# EAGLE design PhotoShieldV2 (EAGLE 9.2.2)
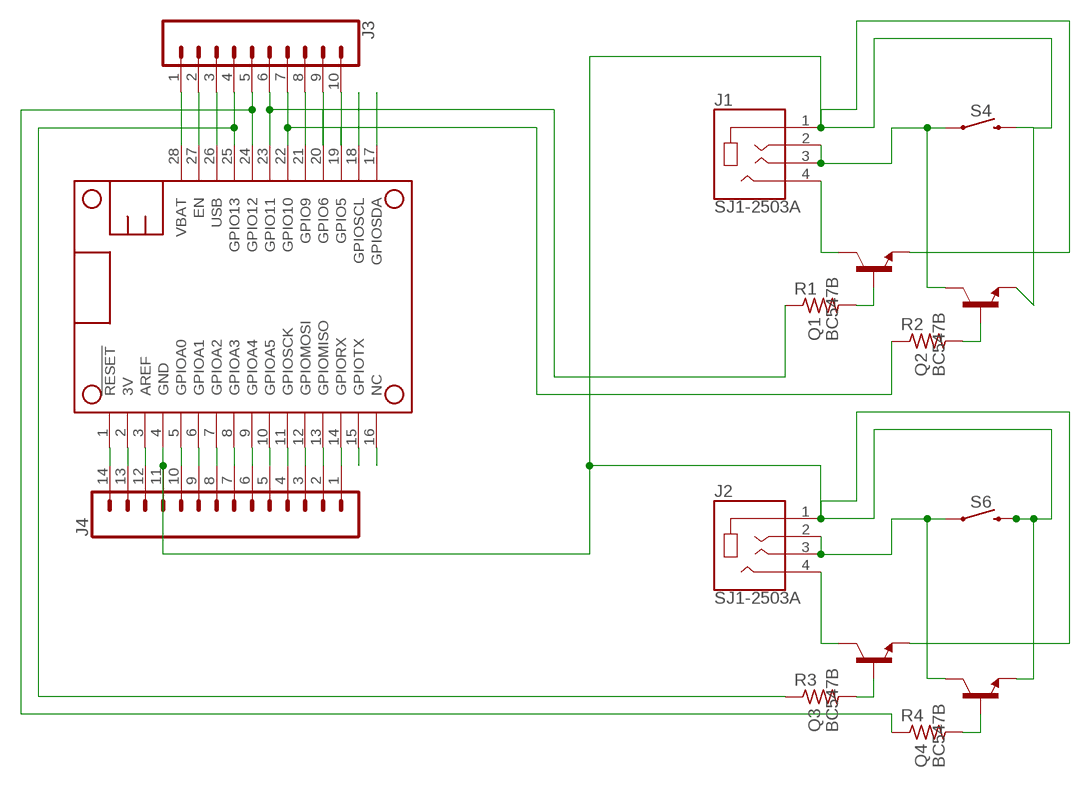
[diagram p0: schematic, sheet 1]

## Parts
J1  SJ1-2503A  [CUI_SJ1-2503A]
J2  SJ1-2503A  [CUI_SJ1-2503A]
J3  CONN_10"  [1X10]
J4  CONN_14  [1X14]
MS1  FEATHERWING  [FEATHERWING]
Q1  BC547B  [TO92]
Q2  BC547B  [TO92]
Q3  BC547B  [TO92]
Q4  BC547B  [TO92]
R1  R-US_R0805  [R0805]
R2  R-US_R0805  [R0805]
R3  R-US_R0805  [R0805]
R4  R-US_R0805  [R0805]
S4  MOMENTARY-SWITCH-SPST-SMD-4.6X2.8MM  [TACTILE_SWITCH_SMD_4.6X2.8MM]
S6  MOMENTARY-SWITCH-SPST-SMD-4.6X2.8MM  [TACTILE_SWITCH_SMD_4.6X2.8MM]

## Nets
3V: J4.13 MS1.2(3V)
N$1: J3.7 MS1.22(GPIO10) R2.1
N$2: J1.4 Q1.3(C)
N$3: J1.2 J1.3 Q2.3(C) S4.1 S4.2
N$5: Q2.2(B) R2.2
N$6: J3.2 MS1.27(EN)
N$7: Q1.2(B) R1.2
N$8: J2.4 Q3.3(C)
N$9: J1.1 J2.1 J4.11 MS1.4(GND) Q1.1(E) Q2.1(E) Q3.1(E) Q4.1(E) S4.3 S4.4 S6.3 S6.4
N$10: J2.2 J2.3 Q4.3(C) S6.1 S6.2
N$11: J3.4 MS1.25(GPIO13) R3.1
N$12: Q4.2(B) R4.2
N$13: J3.5 MS1.24(GPIO12) R4.1
N$14: Q3.2(B) R3.2
N$15: J4.14 MS1.1(!RESET)
N$16: J4.12 MS1.3(AREF)
N$18: J4.10 MS1.5(GPIOA0)
N$19: J4.9 MS1.6(GPIOA1)
N$20: J4.8 MS1.7(GPIOA2)
N$21: J4.7 MS1.8(GPIOA3)
N$22: J4.6 MS1.9(GPIOA4)
N$23: J4.5 MS1.10(GPIOA5)
N$24: J4.4 MS1.11(GPIOSCK)
N$25: J4.3 MS1.12(GPIOMOSI)
N$26: J4.2 MS1.13(GPIOMISO)
N$27: J4.1 MS1.14(GPIORX)
N$28: MS1.15(GPIOTX)
N$29: MS1.16(NC)
N$30: MS1.17(GPIOSDA)
N$31: MS1.18(GPIOSCL)
N$34: J3.6 MS1.23(GPIO11) R1.1
N$37: J3.8 MS1.21(GPIO9)
N$38: J3.9 MS1.20(GPIO6)
N$39: J3.10 MS1.19(GPIO5)
USB: J3.3 MS1.26(USB)
VBAT: J3.1 MS1.28(VBAT)

## Library data of the parts
J1 J2 = SJ1-2503A:SJ1-2503A: Conn 2.5MM Stereo Jack F 4 POS Solder RA Thru-Hole 4 Terminal 1 Port; MANUFACTURER: CUI INC; REV: B; STANDARD: Manufacturer Recommendation
J3 = SparkFun-Connectors:CONN_10: Multi connection point. Often used as Generic Header-pin footprint for 0.1 inch spaced/style header connections On any of the 0.1 inch spaced packages, you can populate with these: Break Away Headers - Straight <https://www.sparkfun.com/products/116> (PRT-00116) Break Away Male Headers - Right Angle <https://www.sparkfun.com/products/553> (PRT-00553) Female Headers <https://www.sparkfun.com/products/115> (PRT-00115) Break Away Headers - Machine Pin <https://www.sparkfun.com/products/117> (PRT-00117) Break Away Female Headers - Swiss Machine Pin <https://www.sparkfun.com/products/743> (PRT-00743) Arduino Stackable Header - 10 Pin <https://www.sparkfun.com/products/11376> (PRT-11376) For SCREWTERMINALS and SPRING TERMINALS visit here: Screw Terimnals on SparkFun.com <https://www.sparkfun.com/search/results?term=Screw+Terminals> (5mm/3.5mm/2.54mm spacing) This device is also useful as a general connection point to wire up your design to another part of your project. Our various solder wires solder well into these plated through hole pads. Hook-Up Wire - Assortment (Stranded, 22 AWG) <https://www.sparkfun.com/products/11375> (PRT-11375) Hook-Up Wire - Assortment (Solid Core, 22 AWG) <https://www.sparkfun.com/products/11367> (PRT-11367) View the entire wire category on our website here <https://www.sparkfun.com/categories/141> Special notes: Molex polarized connector foot print use with SKU : PRT-08231 with associated crimp pins and housings. 1MM SMD Version SKU: PRT-10208 NOTES ON THE VARIANTS LOCK and LOCK_LONGPADS... This footprint was designed to help hold the alignment of a through-hole component (i.e. 6-pin header) while soldering it into place. You may notice that each hole has been shifted either up or down by 0.005 of an inch from it's more standard position (which is a perfectly straight line). This slight alteration caused the pins (the squares in the middle) to touch the edges of the holes. Because they are alternating, it causes a "brace" to hold the component in place. 0.005 has proven to be the perfect amount of "off-center" position when using our standard breakaway headers. Although looks a little odd when you look at the bare footprint, once you have a header in there, the alteration is very hard to notice. Also,if you push a header all the way into place, it is covered up entirely on the bottom side.; PROD_ID: CONN-11563
J4 = SparkFun-Connectors:CONN_14: Multi connection point. Often used as Generic Header-pin footprint for 0.1 inch spaced/style header connections On any of the 0.1 inch spaced packages, you can populate with these: Break Away Headers - Straight <https://www.sparkfun.com/products/116> (PRT-00116) Break Away Male Headers - Right Angle <https://www.sparkfun.com/products/553> (PRT-00553) Female Headers <https://www.sparkfun.com/products/115> (PRT-00115) Break Away Headers - Machine Pin <https://www.sparkfun.com/products/117> (PRT-00117) Break Away Female Headers - Swiss Machine Pin <https://www.sparkfun.com/products/743> (PRT-00743) For SCREWTERMINALS and SPRING TERMINALS visit here: Screw Terimnals on SparkFun.com <https://www.sparkfun.com/search/results?term=Screw+Terminals> (5mm/3.5mm/2.54mm spacing) This device is also useful as a general connection point to wire up your design to another part of your project. Our various solder wires solder well into these plated through hole pads. Hook-Up Wire - Assortment (Stranded, 22 AWG) <https://www.sparkfun.com/products/11375> (PRT-11375) Hook-Up Wire - Assortment (Solid Core, 22 AWG) <https://www.sparkfun.com/products/11367> (PRT-11367) View the entire wire category on our website here <https://www.sparkfun.com/categories/141> Special notes: Molex polarized connector foot print use with SKU : PRT-08231 with associated crimp pins and housings. 1MM SMD Version SKU: PRT-10208 NOTES ON THE VARIANTS LOCK and LOCK_LONGPADS... This footprint was designed to help hold the alignment of a through-hole component (i.e. 6-pin header) while soldering it into place. You may notice that each hole has been shifted either up or down by 0.005 of an inch from it's more standard position (which is a perfectly straight line). This slight alteration caused the pins (the squares in the middle) to touch the edges of the holes. Because they are alternating, it causes a "brace" to hold the component in place. 0.005 has proven to be the perfect amount of "off-center" position when using our standard breakaway headers. Although looks a little odd when you look at the bare footprint, once you have a header in there, the alteration is very hard to notice. Also,if you push a header all the way into place, it is covered up entirely on the bottom side.
MS1 = adafruit:FEATHERWING
Q1-Q4 = transistor-npn:BC547*: NPN Transistor
R1-R4 = adafruit:R-US_: RESISTOR, American symbol
S4 S6 = SparkFun-Switches:MOMENTARY-SWITCH-SPST: Momentary Switch (Pushbutton) - SPST Normally-open (NO) SPST momentary switches (buttons, pushbuttons). Variants PTH-12MM - 12mm square, through-hole Momentary Pushbutton Switch - 12mm Square <https://www.sparkfun.com/products/9190> (COM-09190) PTH-6.0MM, PTH-6.0MM-KIT - 6.0mm square, through-hole Mini Pushbutton Switch <https://www.sparkfun.com/products/97> (COM-00097) KIT package intended for soldering kit's - only one side of pads' copper is exposed. PTH-RIGHT-ANGLE-KIT - Right-angle, through-hole Right Angle Tactile Button <https://www.sparkfun.com/products/10791> - Used on SparkFun BigTime Watch Kit <https://www.sparkfun.com/products/11734> SMD-12MM - 12mm square, surface-mount Tactile Button - SMD (12mm) <https://www.sparkfun.com/products/12993> (COM-12993) Used on SparkFun PicoBoard <https://www.sparkfun.com/products/11888> SMD-4.5MM - 4.5mm Square Trackball Switch Used on SparkFun Blackberry Trackballer Breakout <https://www.sparkfun.com/products/13169> SMD-4.6MMX2.8MM - 4.60mm x 2.80mm, surface mount Used on SparkFun SAMD21 Mini Breakout <https://www.sparkfun.com/products/13664> SMD-5.2MM, SMD-5.2-REDUNDANT - 5.2mm square, surface-mount Mini Pushbutton Switch - SMD <https://www.sparkfun.com/products/8720> (COM-08720) Used on Arduino Pro Mini <https://www.sparkfun.com/products/11114> REDUNDANT package connects both switch circuits together SMD-6.0X3.5MM - 6.0 x 3.5mm, surface mount Momentary Reset Switch SMD <https://www.sparkfun.com/products/8229> (COM-08229) SMD-6.2MM-TALL - 6.2mm square, surface mount Tactile Button - SMD (6mm) <https://www.sparkfun.com/products/12992> Used on SparkFun Digital Sandbox <https://www.sparkfun.com/products/12651> SMD-RIGHT-ANGLE - Right-angle, surface mount Used on SparkFun Block for Intel® Edison - Arduino <https://www.sparkfun.com/products/13036>; PROD_ID: SWCH-13065

## Board
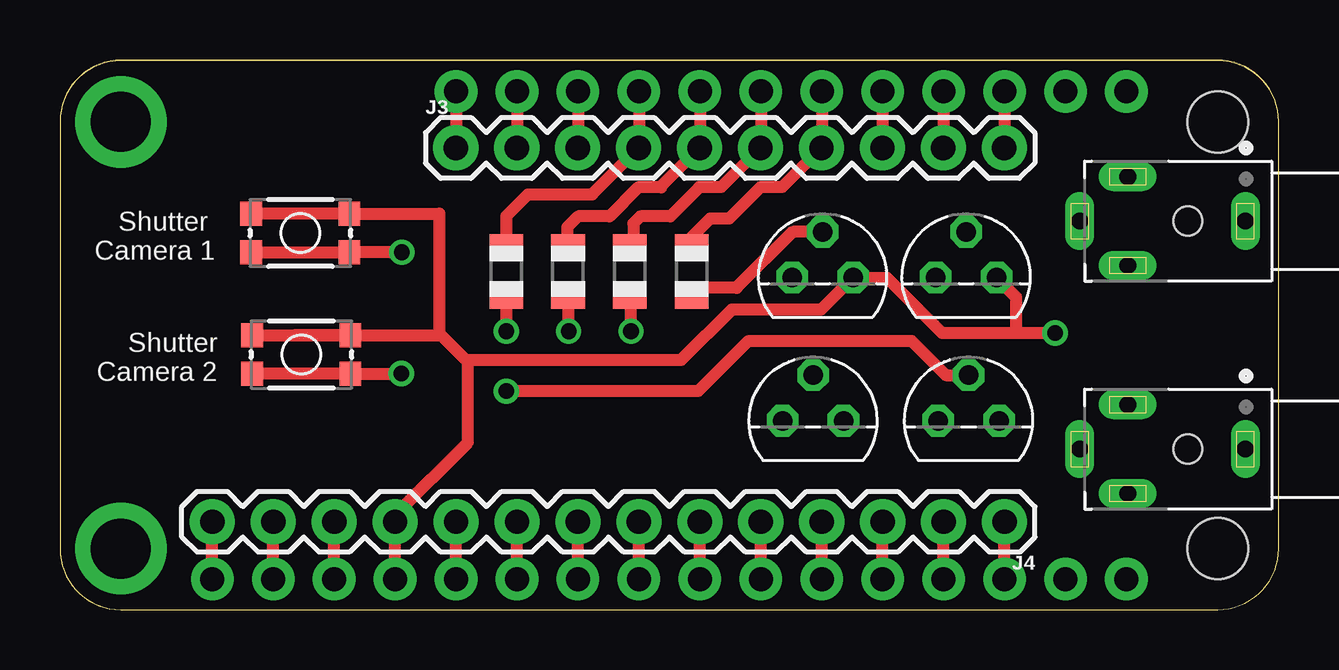
[diagram p1: board, top side]
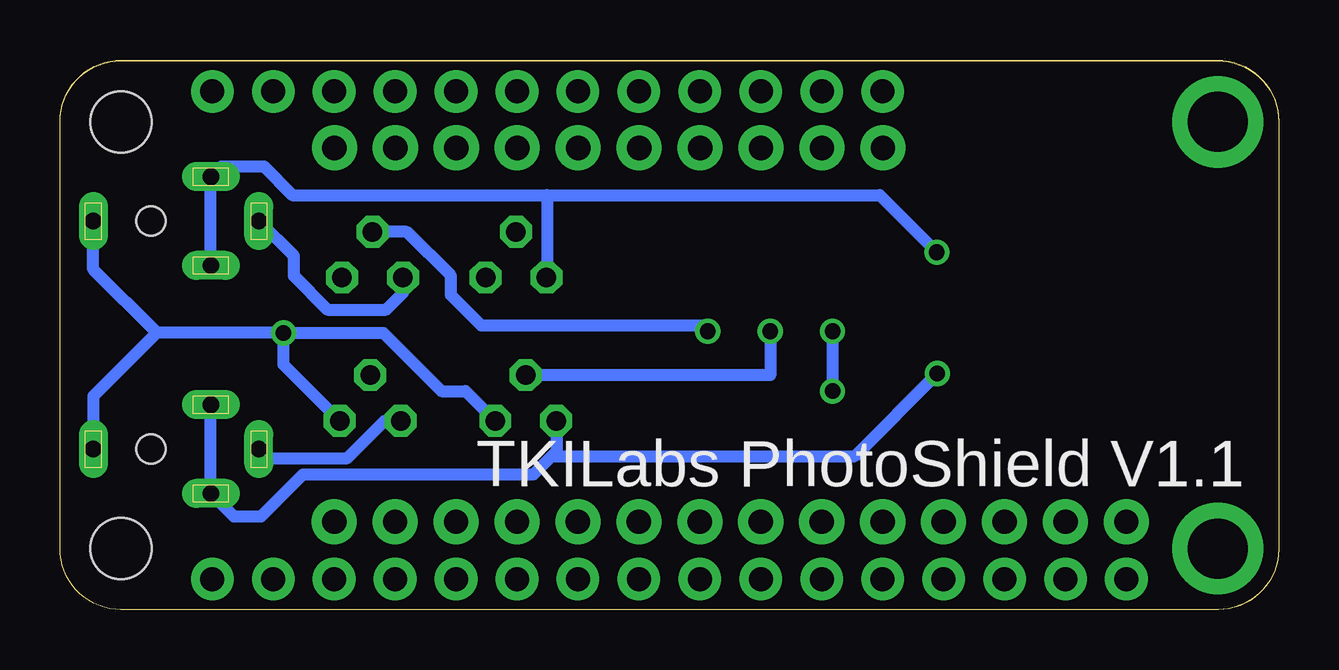
[diagram p2: board, bottom side, seen from below]

Size 50.8 x 22.9 mm. Coordinates in mm from the lower left corner, seen from the top.
Outline: 0,20.34 0,2.52 arc90 2.52,0 48.26,0 arc90 50.8,2.54 50.8,20.34 arc90 48.24,22.9 2.56,22.9 arc90 0,20.34
Copper layers (1*16): Top 0.035mm / dielectric 1.5mm / Bottom 0.035mm
Design rules "default *": minimum track width 20mil, minimum drill 0.35mm, track to track 6mil, track to pad 16mil, pad to pad 16mil, via to via 16mil, smd to smd 16mil, copper to edge 40mil, drill to drill 6mil, minimum pad ring 10mil, minimum via ring 8mil, stop-mask expansion 4mil, vias tented up to drill 0mil, thermal gap 10mil

### Footprints (pad centres in the part's own frame; a part is rotated, then mirrored left to right if it is on the bottom)
CUI_SJ1-2503A = drill 0.7 long: 1 0,0; 2 -1.85,-4.9; 3 1.85,-4.9; 4 0,-6.9 | hole 1.2: 0,-2.4
1X10 = drill 1.016 pad 1.88: 1 0,0; 2 2.54,0; 3 5.08,0; 4 7.62,0; 5 10.16,0; 6 12.7,0; 7 15.24,0; 8 17.78,0; 9 20.32,0; 10 22.86,0
1X14 = drill 1.016 pad 1.88: 1 0,0; 2 2.54,0; 3 5.08,0; 4 7.62,0; 5 10.16,0; 6 12.7,0; 7 15.24,0; 8 17.78,0; 9 20.32,0; 10 22.86,0; 11 25.4,0; 12 27.94,0; 13 30.48,0; 14 33.02,0
FEATHERWING = drill 1 pad 1.778: 1 6.35,1.27; 2 8.89,1.27; 3 11.43,1.27; 4 13.97,1.27; 5 16.51,1.27; 6 19.05,1.27; 7 21.59,1.27; 8 24.13,1.27; 9 26.67,1.27; 10 29.21,1.27; 11 31.75,1.27; 12 34.29,1.27; 13 36.83,1.27; 14 39.37,1.27; 15 41.91,1.27; 16 44.45,1.27; 17 44.45,21.59; 18 41.91,21.59; 19 39.37,21.59; 20 36.83,21.59; 21 34.29,21.59; 22 31.75,21.59; 23 29.21,21.59; 24 26.67,21.59; 25 24.13,21.59; 26 21.59,21.59; 27 19.05,21.59; 28 16.51,21.59 | drill 2.5 pad 3.81: P$1 2.54,20.32; P$2 2.54,2.54 | hole 2.54: 48.26,20.32; 48.26,2.54
TO92 = drill 0.813 octagon: 1 1.27,0; 2 0,1.905; 3 -1.27,0
R0805 = smd 1.1 x 1.4: 1 -1,0; 2 1,0
TACTILE_SWITCH_SMD_4.6X2.8MM = smd 0.9 x 1: 1 -2.05,-0.8; 2 2.05,-0.8; 3 2.05,0.8; 4 -2.05,0.8

### Placement (x,y rotation side)
J1  49.41,16.19 270 top
J2  49.41,6.69 270 top
J3  16.5,19.24 0 top
J4  39.37,3.66 180 top
MS1  0,0 0 top
Q1  37.77,13.84 0 top
Q2  31.79,13.84 0 top
Q3  37.87,7.87 0 top
Q4  31.39,7.87 0 top
R1  23.75,14.09 270 top
R2  26.33,14.09 270 top
R3  18.6,14.09 270 top
R4  21.18,14.09 270 top
S4  10.02,15.7 0 top
S6  10.06,10.63 0 top

### Tracks (layer width: path | path; a pad name or v marks a point on that pad's centre or on a via)
3V
  Top 0.508: MS1.2 J4.13
N$1
  Top 0.508: 26.22,15.2 R2.1 26.33,15.52 27.1,16.29 27.89,16.29 29.2,17.6 30.1,17.6 J3.7 MS1.22
N$2
  Bottom 0.508: Q1.3 36.5,13.2 37.2,12.5 39.65,12.5 41.05,13.9 41.05,14.73 J1.4
N$3  (via drill 0.65)
  Top 0.508: v14.25,14.89 v14.24,14.9 S4.2 S4.1
  Bottom 0.508: Q2.3 30.5,13.86 30.5,17.27 | J1.3 J1.2 44.08,18.47 42.31,18.47 41.11,17.27 30.5,17.27 | 30.5,17.27 16.63,17.27 v14.25,14.89
N$5
  Top 0.508: Q2.2 30.54,15.74 28.2,13.4 26.64,13.4 R2.2
N$6
  Top 0.508: MS1.27 J3.2
N$7  (via drill 0.65)
  Top 0.508: v23.8,11.6 23.8,13.04 R1.2
  Bottom 0.508: v23.8,11.6 24.04,11.84 33.24,11.84 34.5,13.1 34.5,13.9 36.34,15.74 Q1.2
N$8
  Bottom 0.508: Q3.3 37.27,7.87 38.82,6.32 42.14,6.32 J2.4
N$9  (via drill 0.65)
  Top 0.508: S6.3 9.77,11.43 | S6.4 S6.3 | 17,10.4 16.91,10.4 15.88,11.43 | 17,10.4 25.9,10.4 28,12.5 31.72,12.5 Q2.1 34.46,13.84 36.77,11.53 39.85,11.53 | 15.88,11.43 15.8,11.51 15.81,11.51 15.81,16.5 S4.3 S4.4 | MS1.4 J4.11 13.97,3.95 17,6.98 17,10.4 | 39.85,11.53 v41.48,11.53 | Q1.1 39.85,13.03 39.85,11.53 | S6.3 15.88,11.43
  Bottom 0.508: Q4.1 33.9,9.1 34.9,9.1 37.33,11.53 v41.48,11.53 | Q3.1 41.48,10.21 v41.48,11.53 | v41.48,11.53 46.77,11.53 | J1.1 49.41,14.17 46.77,11.53 | 46.77,11.53 49.41,8.89 J2.1
N$10  (via drill 0.65)
  Top 0.508: S6.1 S6.2 v14.22,9.83 v14.23,9.84
  Bottom 0.508: Q4.3 30.1,7.85 30.1,6.6 30.3,6.4 | 30.3,6.4 17.67,6.4 v14.23,9.84 | J2.2 J2.3 43.54,3.87 42.42,3.87 40.66,5.63 31.07,5.63 30.3,6.4
N$11
  Top 0.508: R3.1 18.6,16.4 19.5,17.3 22.18,17.3 J3.4 MS1.25
N$12  (via drill 0.65)
  Top 0.508: R4.2 21.18,11.62 v21.2,11.6
  Bottom 0.508: v21.2,11.6 v21.19,11.59 21.19,9.77 Q4.2
N$13
  Top 0.508: R4.1 21.14,15.13 21.14,15.93 21.6,16.39 22.9,16.39 24.1,17.59 25.06,17.59 25.06,17.64 J3.5 MS1.24
N$14  (via drill 0.65)
  Top 0.508: R3.2 v18.6,11.6 | Q3.2 36.92,9.77 35.49,11.2 28.7,11.2 26.6,9.1 v18.6,9.1
  Bottom 0.508: v18.6,11.6 v18.6,9.1
N$15
  Top 0.508: MS1.1 J4.14
N$16
  Top 0.508: MS1.3 J4.12
N$18
  Top 0.508: MS1.5 J4.10
N$19
  Top 0.508: MS1.6 J4.9
N$20
  Top 0.508: MS1.7 J4.8
N$21
  Top 0.508: MS1.8 J4.7
N$22
  Top 0.508: MS1.9 J4.6
N$23
  Top 0.508: MS1.10 J4.5
N$24
  Top 0.508: MS1.11 J4.4
N$25
  Top 0.508: MS1.12 J4.3
N$26
  Top 0.508: MS1.13 J4.2
N$27
  Top 0.508: MS1.14 J4.1
N$34
  Top 0.508: R1.1 23.9,15.24 23.9,16.1 24.19,16.39 25.44,16.39 26.65,17.6 27.56,17.6 J3.6 MS1.23
N$37
  Top 0.508: MS1.21 J3.8
N$38
  Top 0.508: MS1.20 J3.9
N$39
  Top 0.508: MS1.19 J3.10
USB
  Top 0.508: MS1.26 J3.3
VBAT
  Top 0.508: MS1.28 J3.1

### Text on the board
tNames: Shutter / Camera 1 | Shutter / Camera 2
bNames: TKILabs PhotoShield V1.1